# EAGLE design Tracksoar programmer shield (EAGLE 7.5.0)
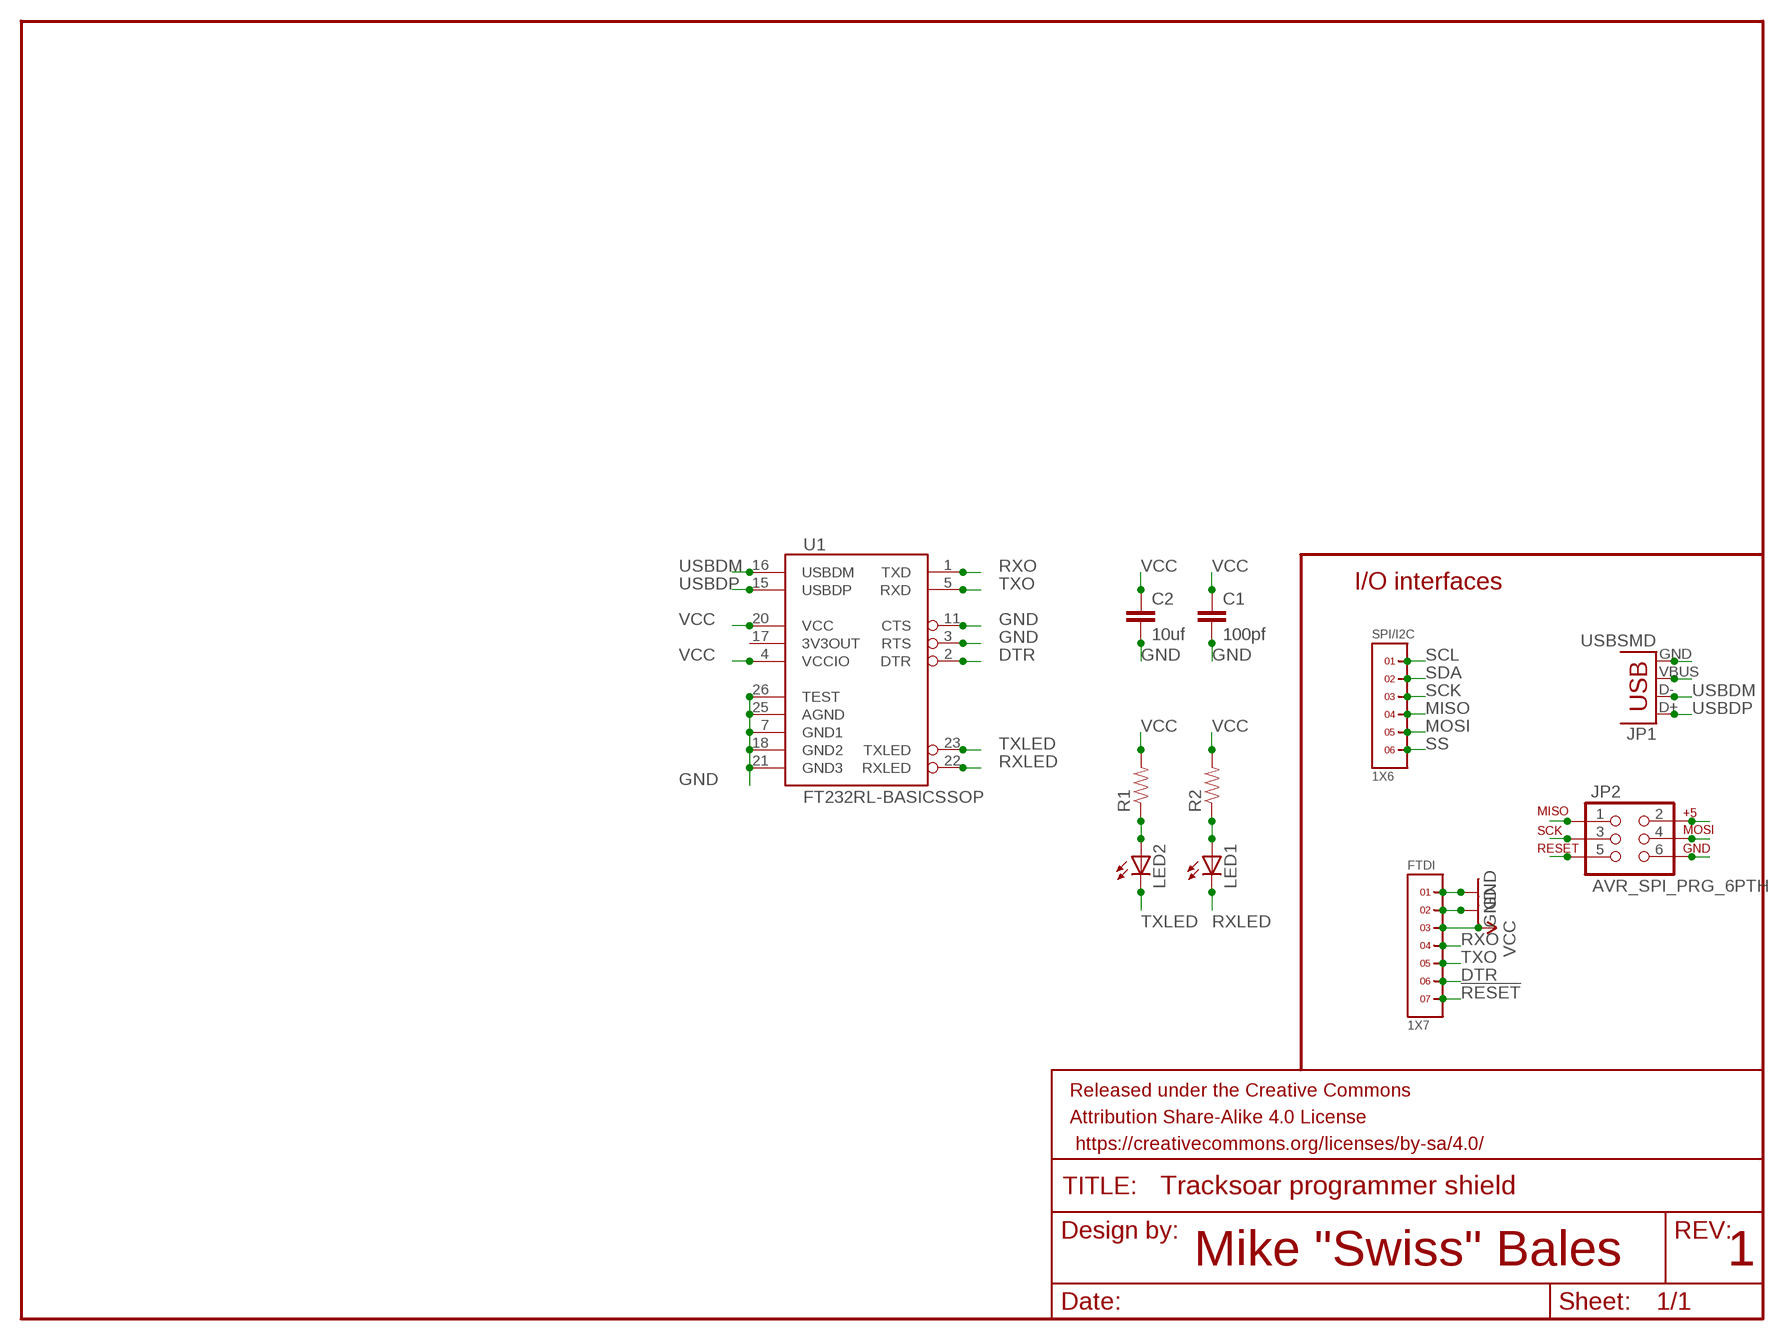
[diagram p0: schematic, sheet 1]

## Parts
C1  100pf  CAP0805  [0805]
C2  10uf  CAP0805  [0805]
FRAME1  FRAME-LETTER  [CREATIVE_COMMONS]
FTDI  1X7  [1X7]
JP1  USBSMD  [USB-MINIB]
JP2  AVR_SPI_PRG_6PTH  [2X3]
LED1  LEDCHIP-LED0805  [CHIP-LED0805]
LED2  LEDCHIP-LED0805  [CHIP-LED0805]
R1  RESISTOR0805-RES  [0805]
R2  RESISTOR0805-RES  [0805]
SPI/I2C  1X6  [1X6]
U1  FT232RL-BASICSSOP  [SSOP28DB]

## Nets
!RESET: FTDI.7 JP2.5
DTR: FTDI.6 U1.2(DTR)
GND: C1.2 C2.2 FTDI.1 FTDI.2 JP1.GND JP2.6 U1.3(RTS) U1.7(GND1) U1.11(CTS) U1.18(GND2) U1.21(GND3) U1.25(AGND) U1.26(TEST)
MISO: JP2.1 SPI/I2C.4
MOSI: JP2.4 SPI/I2C.5
N$1: LED2.A R1.1
N$2: LED1.A R2.1
RXLED: LED1.C U1.22(RXLED)
RXO: FTDI.4 U1.1(TXD)
SCK: JP2.3 SPI/I2C.3
SCL: SPI/I2C.1
SDA: SPI/I2C.2
SS: SPI/I2C.6
TXLED: LED2.C U1.23(TXLED)
TXO: FTDI.5 U1.5(RXD)
USBDM: JP1.D- U1.16(USBDM)
USBDP: JP1.D+ U1.15(USBDP)
VCC: C1.1 C2.1 FTDI.3 JP1.VBUS JP2.2 R1.2 R2.2 U1.4(VCCIO) U1.20(VCC)
Unconnected: U1.17(3V3OUT)

## Notes on the sheet
- I/O interfaces
- Mike "Swiss" Bales | 1

## Library data of the parts
C1 C2 = SparkFun-Capacitors:CAP: Capacitor Standard 0603 ceramic capacitor, and 0.1" leaded capacitor.
FRAME1 = SparkFun-Aesthetics:FRAME-LETTER: Schematic Frame Standard 8.5x11 US Letter frame
FTDI = headers(2mm):1X7
JP1 = SparkFun-Connectors:USB: USB Connectors USB-B-PTH is fully proven SKU : PRT-00139/CONN-08278 USB-miniB is fully proven SKU : PRT-00587 USB-A-PCB is untested. USB-A-H is throughly reviewed, but untested. Spark Fun Electronics SKU : PRT-00437 USB-B-SMT is throughly reviewed, but untested. Needs silkscreen touching up. USB-A-S has not been used/tested USB-MB-H has not been used/tested USB-MICROB has been used. CONN-09505; PROD_ID: CONN-08193
JP2 = SparkFun-Connectors:AVR_SPI_PRG_6: AVR ISP 6 Pin This is the reduced ISP connector for AVR programming. Common on Arduino. This footprint will take up less PCB space and can be used with a 10-pin to 6-pin adapter such as SKU: BOB-08508 **Special note about "TEST_POINT" package. The stop mask is on the top side, so if you want your programming test points to be on the bottom of your board, make sure to place this package on the bottom side of the board. This also ensure that the orientation to program from the bottom side will be correct.
LED1 LED2 = adafruit:LED: LED OSRAM: - CHIPLED LG R971, LG N971, LY N971, LG Q971, LY Q971, LO R971, LY R971 LH N974, LH R974 LS Q976, LO Q976, LY Q976 LO Q996 - Hyper CHIPLED LW Q18S LB Q993, LB Q99A, LB R99A - SideLED LS A670, LO A670, LY A670, LG A670, LP A670 LB A673, LV A673, LT A673, LW A673 LH A674 LY A675 LS A676, LA A676, LO A676, LY A676, LW A676 LS A679, LY A679, LG A679 - Hyper Micro SIDELED® LS Y876, LA Y876, LO Y876, LY Y876 LT Y87S - SmartLED LW L88C, LW L88S LB L89C, LB L89S, LG L890 LS L89K, LO L89K, LY L89K LS L896, LA L896, LO L896, LY L896 - TOPLED LS T670, LO T670, LY T670, LG T670, LP T670 LSG T670, LSP T670, LSY T670, LOP T670, LYG T670 LG T671, LOG T671, LSG T671 LB T673, LV T673, LT T673, LW T673 LH T674 LS T676, LA T676, LO T676, LY T676, LB T676, LH T676, LSB T676, LW T676 LB T67C, LV T67C, LT T67C, LS T67K, LO T67K, LY T67K, LW E67C LS E67B, LA E67B, LO E67B, LY E67B, LB E67C, LV E67C, LT E67C LW T67C LS T679, LY T679, LG T679 LS T770, LO T770, LY T770, LG T770, LP T770 LB T773, LV T773, LT T773, LW T773 LH T774 LS E675, LA E675, LY E675, LS T675 LS T776, LA T776, LO T776, LY T776, LB T776 LHGB T686 LT T68C, LB T68C - Hyper Mini TOPLED® LB M676 - Mini TOPLED Santana® LG M470 LS M47K, LO M47K, LY M47K Source: http://www.osram.convergy.de/
R1 R2 = SparkFun-Passives:RESISTOR: Resistor Basic schematic elements and footprints for 0603, 1206, and PTH resistors.
SPI/I2C = headers(2mm):1X6
U1 = SparkFun-DigitalIC:FT232RL-BASIC: USB UART This is the simplified version of the FT232RL unit. Only what you need, nothing you don't. Spark Fun Electronics SKU : COM-00650

## Board
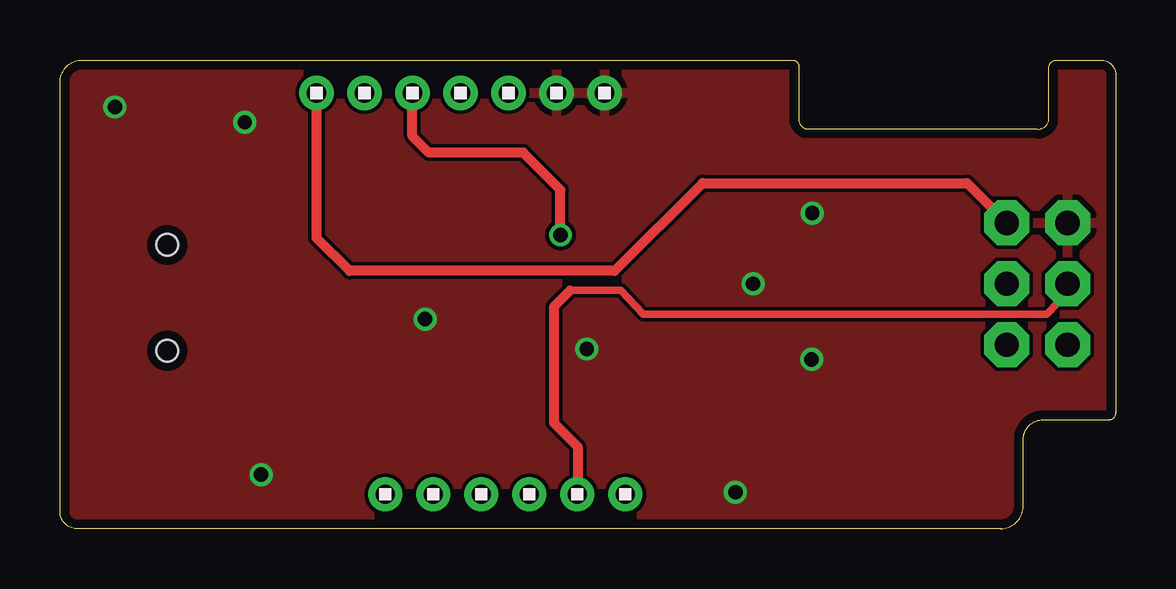
[diagram p1: board, top side]
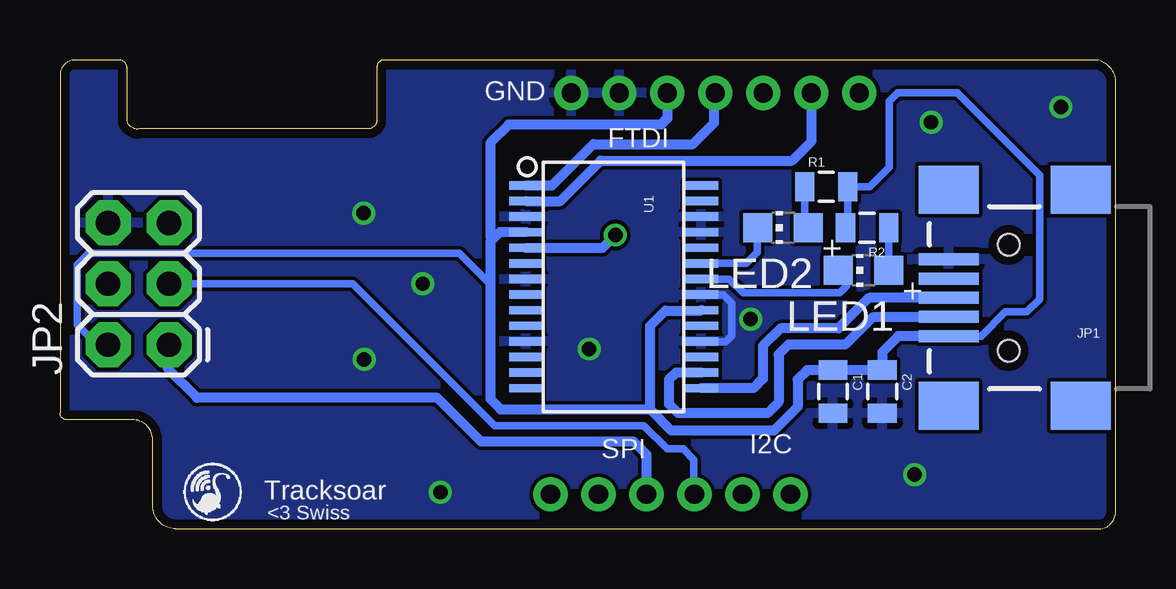
[diagram p2: board, bottom side, seen from below]

Size 43.99 x 19.53 mm. Coordinates in mm from the lower left corner, seen from the top.
Outline: 0.69,0 arc-90 0,0.76 0,18.67 arc-90 0.99,19.53 30.53,19.53 arc-90 30.79,19.23 30.79,17.02 arc90 31.19,16.66 40.69,16.66 arc90 41.2,17.02 41.2,19.23 arc-90 41.56,19.53 43.38,19.53 arc-90 43.99,18.87 43.99,4.83 arc-90 43.71,4.55 40.97,4.55 arc90 40.13,3.71 40.13,0.94 arc-90 39.19,0 0.69,0
Copper layers (1*16): Top 0.0356mm / dielectric 1.5011mm / Bottom 0.0356mm
Design rules "oshpark-2layer": minimum track width 6mil, minimum drill 13mil, track to track 6mil, track to pad 6mil, pad to pad 6mil, via to via 6mil, smd to smd 6mil, copper to edge 15mil, drill to drill 6mil, minimum pad ring 7mil, minimum via ring 7mil, stop-mask expansion 4mil, vias tented up to drill 0mil, thermal gap 10mil

### Footprints (pad centres in the part's own frame; a part is rotated, then mirrored left to right if it is on the bottom)
0805 = smd 0.8 x 1.2: 1 -0.9,0; 2 0.9,0
1X7 = drill 0.8 pad 1.422: 1 -6,0; 2 -4,0; 3 -2,0; 4 0,0; 5 2,0; 6 4,0; 7 6,0
USB-MINIB = smd 2.5 x 0.5: D+ 2.5,0; D- 2.5,0.8; GND 2.5,-1.6; ID 2.5,-0.8; VBUS 2.5,1.6 | smd 2.5 x 2: MTN1 -3,4.5; MTN2 2.5,4.5; MTN3 -3,-4.5; MTN4 2.5,-4.5 | hole 0.9: 0,2.2; 0,-2.2
2X3 = drill 1.016 pad 1.88 octagon: 1 0,0; 2 0,2.54; 3 2.54,0; 4 2.54,2.54; 5 5.08,0; 6 5.08,2.54
CHIP-LED0805 = smd 1.2 x 1.2: A 0,-1.05; C 0,1.05
1X6 = drill 0.8 pad 1.422: 1 -5,0; 2 -3,0; 3 -1,0; 4 1,0; 5 3,0; 6 5,0
SSOP28DB = smd 0.348 x 1.397: 1 -4.225,-3.656; 2 -3.575,-3.656; 3 -2.925,-3.656; 4 -2.275,-3.656; 5 -1.625,-3.656; 6 -0.975,-3.656; 7 -0.325,-3.656; 8 0.325,-3.656; 9 0.975,-3.656; 10 1.625,-3.656; 11 2.275,-3.656; 12 2.925,-3.656; 13 3.575,-3.656; 14 4.225,-3.656; 15 4.225,3.656; 16 3.575,3.656; 17 2.925,3.656; 18 2.275,3.656; 19 1.625,3.656; 20 0.975,3.656; 21 0.325,3.656; 22 -0.325,3.656; 23 -0.975,3.656; 24 -1.625,3.656; 25 -2.275,3.656; 26 -2.925,3.656; 27 -3.575,3.656; 28 -4.225,3.656

### Placement (x,y rotation side)
C1  11.79,5.71 270 bottom
C2  9.73,5.71 270 bottom
FRAME1  14.35,-8.18 0 top  (outside the outline)
FTDI  16.69,18.16 180 top
JP1  4.47,9.63 180 bottom
JP2  39.45,7.67 90 bottom
LED1  10.52,10.77 90 bottom
LED2  13.87,12.55 90 bottom
R1  12.07,14.25 0 bottom
R2  10.36,12.55 180 bottom
SPI/I2C  18.56,1.43 0 top
U1  20.93,10.08 270 bottom

### Tracks (layer width: path | path; a pad name or v marks a point on that pad's centre or on a via)
!RESET
  Top 0.406: FTDI.7 10.69,12.12 12.07,10.74 23.11,10.74 26.77,14.4 37.8,14.4 JP2.5
DTR
  Bottom 0.406: U1.2 23.15,13.66 21.46,15.34 13.49,15.34 12.68,16.15 12.68,18.15 FTDI.6
GND  (via drill 0.6)
  Bottom 0.305: U1.21 16.36,9.76 16,9.4 16,8.05 16.26,7.8 17.26,7.8 U1.18
  other vias: 15.22,8.74 21.95,7.49 7.7,16.94 28.14,1.52 8.38,2.26 2.29,17.58 31.34,13.16 31.32,7.06 28.88,10.21
  pour Bottom: 0,19.63 -0.02,-0.03 40.21,-0.03 40.21,4.5 44.02,4.5 44.02,19.53 41.07,19.53 41.07,16.84 30.94,16.84 30.96,19.63
  pour Top: 0.03,19.63 -0.02,-0.03 40.21,-0.03 40.21,4.5 44.02,4.5 44.02,19.53 41.1,19.53 41.1,16.84 30.94,16.84 30.99,19.63
MISO
  Bottom 0.406: SPI/I2C.4 19.56,3.1 20.09,3.63 26.44,3.63 28.27,5.46 38.28,5.46 39.5,6.68 39.5,7.62 JP2.1
MOSI
  Top 0.305: JP2.4 41.99,9.86 41.12,8.94 24.31,8.94 23.37,9.93 21.26,9.93
  Top 0.406: 21.59,1.47 SPI/I2C.5 21.57,3.43 20.57,4.42 20.57,9.25 21.26,9.93
N$1
  Bottom 0.305: R1.1 12.97,12.69 LED2.A
N$2
  Bottom 0.305: R2.1 LED1.A
RXLED
  Bottom 0.305: U1.22 16.1,10.41 15.52,9.83 11.51,9.83 11.2,10.13 11.2,10.89 LED1.C
RXO
  Bottom 0.406: U1.1 23.49,14.31 21.77,16.03 17.63,16.03 16.74,16.92 16.74,18.11 FTDI.4
SCK
  Bottom 0.305: SPI/I2C.3 17.58,1.46 17.58,2.87 18.03,3.33 18.7,3.33 19.66,4.29 25.88,4.29 31.8,10.21 JP2.3
TXLED
  Bottom 0.305: U1.23 15.41,11.06 14.94,11.53 14.94,12.53 LED2.C
TXO  (via drill 0.6)
  Top 0.406: v20.85,12.24 20.85,14.12 19.3,15.67 15.37,15.67 14.68,16.36 FTDI.5
  Bottom 0.406: U1.5 21.39,11.71 v20.85,12.24
USBDM
  Bottom 0.406: U1.16 18.33,6.51 18.62,6.22 18.62,5.21 18.24,4.83 14.5,4.83 14.05,5.28 14.05,7.26 13.64,7.67 11.28,7.67 10.14,8.81 JP1.D-
USBDP
  Bottom 0.406: JP1.D+ 10.29,9.63 11.56,8.36 13.97,8.36 14.71,7.62 14.71,6.25 15.09,5.87 17.27,5.87 U1.15
VCC
  Bottom 0.305: JP2.2 42.44,7.67 43.28,8.51 43.28,11 42.8,11.48 27.36,11.48 26.06,10.19 | R2.2 arc-264 11.17,12.65 R1.2 10.26,14.25 9.45,15.06 9.45,17.81 9.09,18.16 6.6,18.16 3.18,14.73 3.18,9.58 3.71,9.04 4.6,9.04 5.61,8.03 9.07,8.03
  Bottom 0.406: JP1.VBUS 9.07,8.03 9.73,7.37 C2.1 C1.1 12.87,6.61 13.26,6.22 13.26,5.08 14.25,4.09 18.52,4.09 19.41,4.98 19.41,5.05 | 19.41,5.05 19.41,8.46 18.77,9.09 17.29,9.09 U1.20 | U1.4 25.67,12.36 25.88,12.14 | 25.88,12.14 26.06,11.96 26.06,10.19 26.06,5.41 25.63,4.98 19.48,4.98 19.41,5.05 | FTDI.3 18.69,17.1 18.95,16.84 25.3,16.84 26.06,16.08 26.06,12.14 25.88,12.14

### Text on the board
bNames: GND | FTDI | I2C | SPI | Tracksoar | <3 Swiss